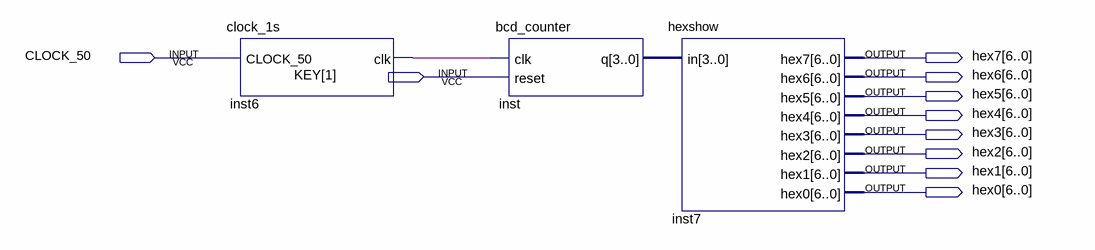
[diagram p0: schematic sheet]
// Quartus schematic Lab3_CE221.bdf as structural Verilog: 3 symbols, 10 pins
module Lab3_CE221 (
  input  CLOCK_50,
  input  [1:1] KEY,
  output [6:0] hex7,
  output [6:0] hex6,
  output [6:0] hex5,
  output [6:0] hex4,
  output [6:0] hex3,
  output [6:0] hex2,
  output [6:0] hex1,
  output [6:0] hex0
);

  wire inst6_clk;
  wire [3:0] inst_q;

  clock_1s inst6 (.CLOCK_50(CLOCK_50), .clk(inst6_clk));
  bcd_counter inst (.clk(inst6_clk), .reset(KEY[1]), .q(inst_q));
  hexshow inst7 (
    .in(inst_q), .hex7(hex7), .hex6(hex6), .hex5(hex5), .hex4(hex4), .hex3(hex3), .hex2(hex2), .hex1(hex1),
    .hex0(hex0));
endmodule
